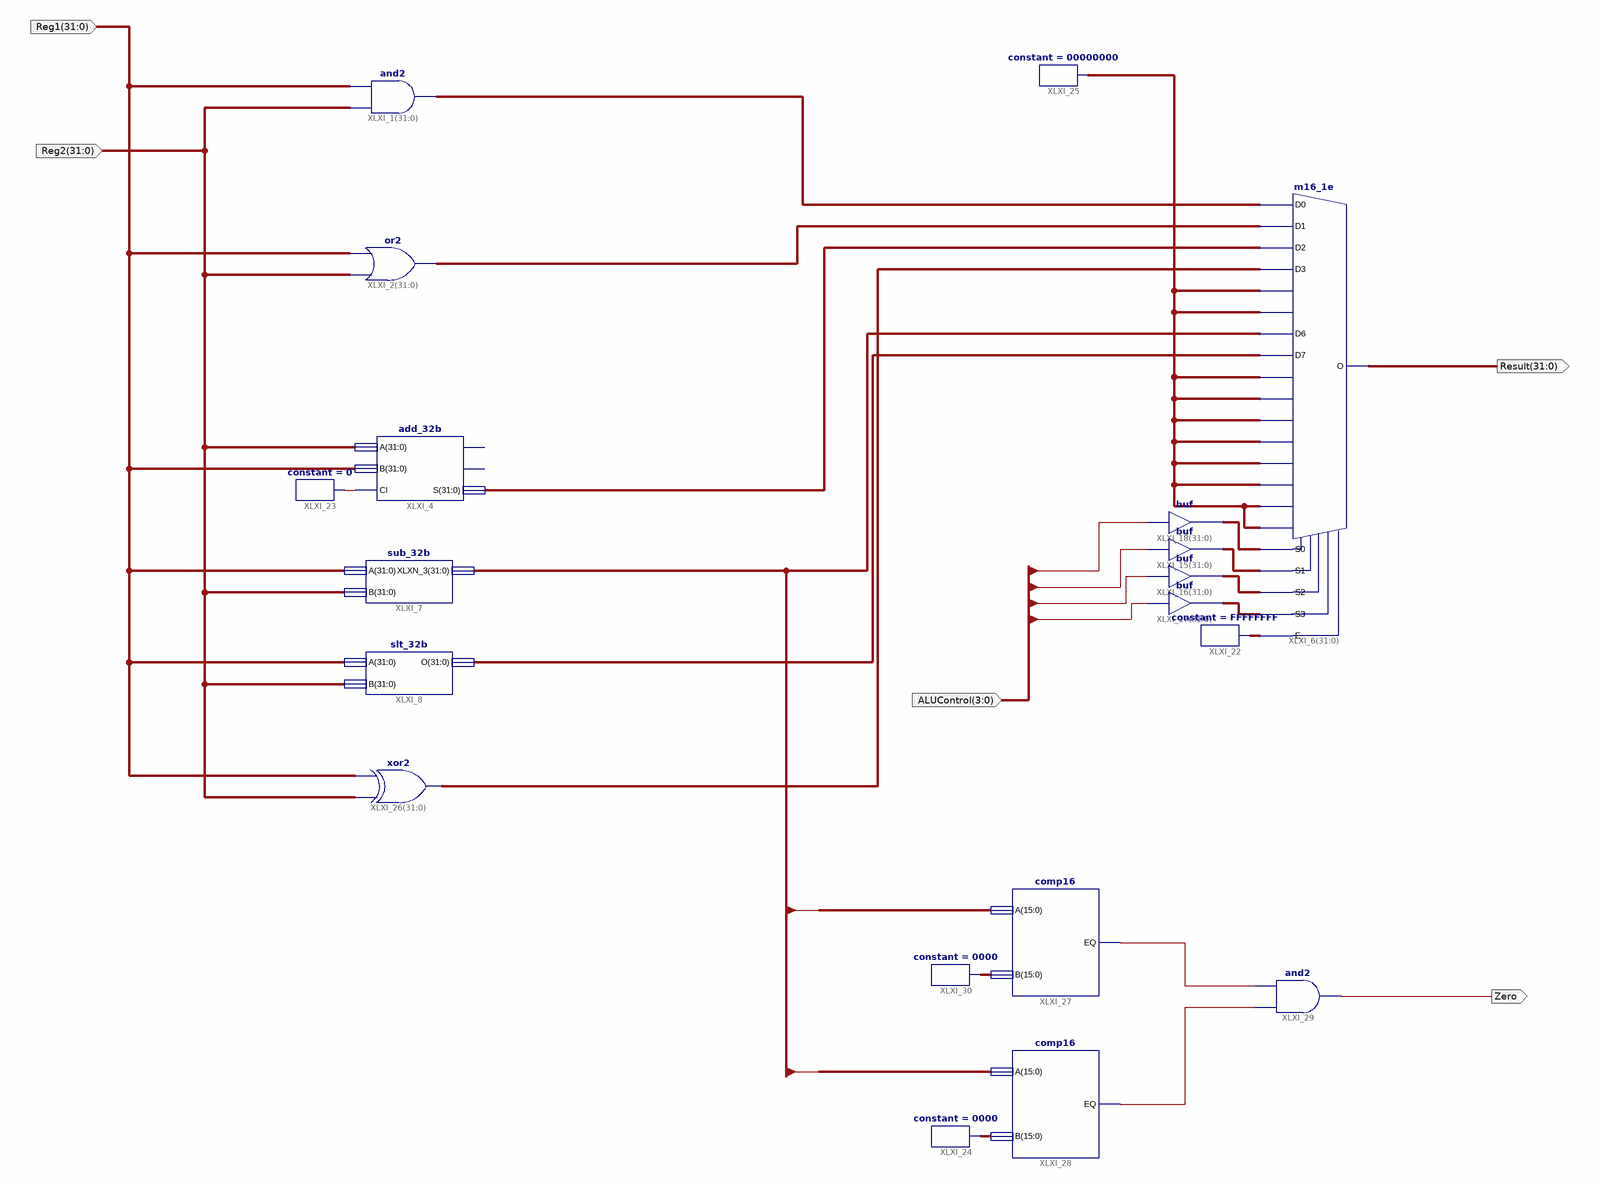
[diagram p0: schematic sheet 1]
// Xilinx ISE schematic ALU.sch (spartan3) as structural Verilog: 19 symbols, 5 ports
module ALU (
  input  [31:0] Reg2,
  input  [31:0] Reg1,
  input  [3:0] ALUControl,
  output [31:0] Result,
  output Zero
);

  wire XLXN_60, XLXN_61, XLXN_65;
  wire [15:0] XLXN_62, XLXN_63;
  wire [31:0] XLXN_5, XLXN_7, XLXN_15, XLXN_22, XLXN_23, XLXN_24, XLXN_39, XLXN_40, XLXN_41, XLXN_43,
       XLXN_48, XLXN_57;

  assign XLXN_15 = Reg2 & Reg1;  // and2 XLXI_1[31..0], 32 bits wide
  assign XLXN_5 = Reg2 | Reg1;  // or2 XLXI_2[31..0], 32 bits wide
  sub_32b XLXI_7 (.A(Reg1), .B(Reg2), .XLXN_3(XLXN_22));
  slt_32b XLXI_8 (.A(Reg1), .B(Reg2), .O(XLXN_23));
  add_32b XLXI_4 (.A(Reg2), .B(Reg1), .CI(XLXN_65), .S(XLXN_7));  // open: OFL, CO
  m16_1e XLXI_6[31:0] (
    .D0(XLXN_15), .D1(XLXN_5), .D10(XLXN_57), .D11(XLXN_57), .D12(XLXN_57), .D13(XLXN_57), .D14(XLXN_57),
    .D15(XLXN_57), .D2(XLXN_7), .D3(XLXN_24), .D4(XLXN_57), .D5(XLXN_57), .D6(XLXN_22), .D7(XLXN_23),
    .D8(XLXN_57), .D9(XLXN_57), .E(XLXN_48), .S0(XLXN_39), .S1(XLXN_40), .S2(XLXN_41), .S3(XLXN_43),
    .O(Result));
  assign XLXN_40 = {32{ALUControl[1]}};  // buf XLXI_15[31..0], 32 bits wide
  assign XLXN_41 = {32{ALUControl[2]}};  // buf XLXI_16[31..0], 32 bits wide
  assign XLXN_43 = {32{ALUControl[3]}};  // buf XLXI_17[31..0], 32 bits wide
  assign XLXN_39 = {32{ALUControl[0]}};  // buf XLXI_18[31..0], 32 bits wide
  constant #(.CValue("FFFFFFFF")) XLXI_22 (.O(XLXN_48));
  constant #(.CValue("00000000")) XLXI_25 (.O(XLXN_57));
  assign XLXN_24 = Reg2 ^ Reg1;  // xor2 XLXI_26[31..0], 32 bits wide
  comp16 XLXI_27 (.A(XLXN_22[15:0]), .B(XLXN_63), .EQ(XLXN_60));
  comp16 XLXI_28 (.A(XLXN_22[31:16]), .B(XLXN_62), .EQ(XLXN_61));
  and XLXI_29 (Zero, XLXN_61, XLXN_60);
  constant #(.CValue("0000")) XLXI_24 (.O(XLXN_62));
  constant #(.CValue("0000")) XLXI_30 (.O(XLXN_63));
  constant #(.CValue("0")) XLXI_23 (.O(XLXN_65));
endmodule
